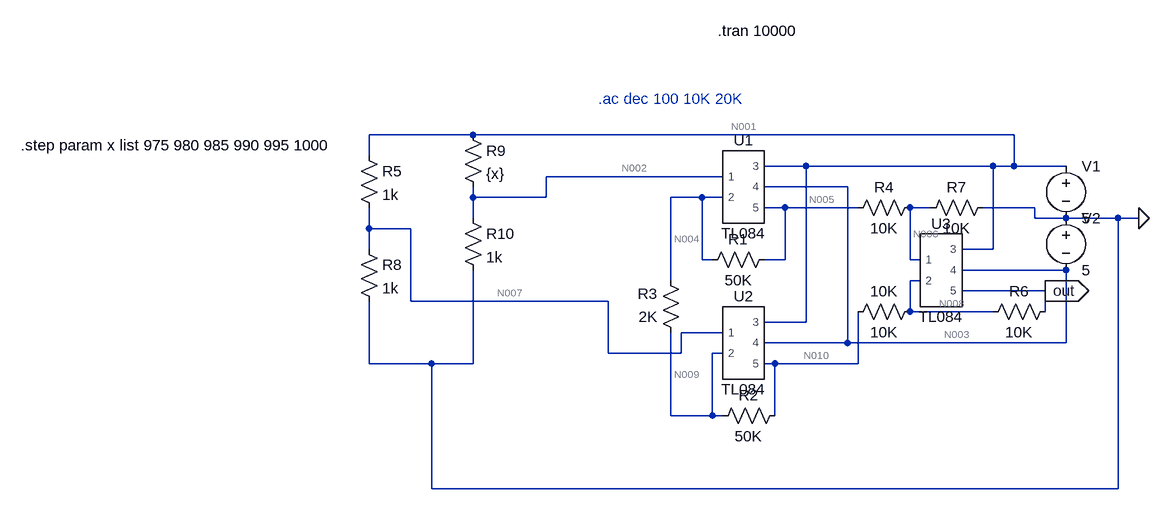
[diagram p0: schematic Draft4.asc]
Draft4.asc, the LTspice schematic file:
Version 4
SHEET 1 880 680
WIRE -400 -48 -560 -48
WIRE 432 -48 -400 -48
WIRE -560 -16 -560 -48
WIRE 112 0 48 0
WIRE 400 0 112 0
WIRE 432 0 432 -48
WIRE 432 0 400 0
WIRE 512 0 432 0
WIRE -16 16 -288 16
WIRE 176 32 48 32
WIRE -400 48 -400 32
WIRE -288 48 -288 16
WIRE -288 48 -400 48
WIRE -48 48 -96 48
WIRE -16 48 -48 48
WIRE 80 64 48 64
WIRE 192 64 80 64
WIRE 304 64 272 64
WIRE 464 64 384 64
WIRE -400 80 -400 48
WIRE 464 80 464 64
WIRE 512 80 464 80
WIRE 592 80 512 80
WIRE 624 80 592 80
WIRE -560 96 -560 64
WIRE -496 96 -560 96
WIRE -560 128 -560 96
WIRE 400 128 400 0
WIRE 400 128 352 128
WIRE -48 144 -48 48
WIRE -32 144 -48 144
WIRE 80 144 80 64
WIRE 80 144 48 144
WIRE 272 144 272 64
WIRE 288 144 272 144
WIRE 512 160 352 160
WIRE -96 176 -96 48
WIRE 288 176 272 176
WIRE 480 192 352 192
WIRE -496 208 -496 96
WIRE -192 208 -496 208
WIRE 272 224 272 176
WIRE 400 224 272 224
WIRE 480 224 480 192
WIRE 112 240 112 0
WIRE 112 240 48 240
WIRE -16 256 -80 256
WIRE 176 272 176 32
WIRE 176 272 48 272
WIRE 512 272 512 160
WIRE 512 272 176 272
WIRE -192 288 -192 208
WIRE -80 288 -80 256
WIRE -80 288 -192 288
WIRE -16 288 -32 288
WIRE -560 304 -560 208
WIRE -464 304 -560 304
WIRE -400 304 -400 160
WIRE -400 304 -464 304
WIRE 64 304 48 304
WIRE 192 304 192 224
WIRE 192 304 64 304
WIRE -96 384 -96 256
WIRE -32 384 -32 288
WIRE -32 384 -96 384
WIRE -16 384 -32 384
WIRE 64 384 64 304
WIRE -464 496 -464 304
WIRE 592 496 592 80
WIRE 592 496 -464 496
FLAG 624 80 0
FLAG 480 192 out
IOPIN 480 192 Out
SYMBOL TL084 16 32 R0
SYMATTR InstName U1
SYMBOL TL084 16 272 R0
SYMATTR InstName U2
SYMBOL TL084 320 160 R0
SYMATTR InstName U3
SYMBOL voltage 512 -16 R0
WINDOW 123 0 0 Left 0
WINDOW 39 0 0 Left 0
SYMATTR InstName V1
SYMATTR Value 5
SYMBOL voltage 512 64 R0
WINDOW 123 0 0 Left 0
WINDOW 39 0 0 Left 0
SYMATTR InstName V2
SYMATTR Value 5
SYMBOL res 64 128 R90
WINDOW 0 0 56 VBottom 2
WINDOW 3 32 56 VTop 2
SYMATTR InstName R1
SYMATTR Value 50K
SYMBOL res 80 368 R90
WINDOW 0 0 56 VBottom 2
WINDOW 3 32 56 VTop 2
SYMATTR InstName R2
SYMATTR Value 50K
SYMBOL res -80 272 R180
WINDOW 0 36 76 Left 2
WINDOW 3 36 40 Left 2
SYMATTR InstName R3
SYMATTR Value 2K
SYMBOL res 176 80 R270
WINDOW 0 32 56 VTop 2
WINDOW 3 0 56 VBottom 2
SYMATTR InstName R4
SYMATTR Value 10K
SYMBOL res 176 240 R270
WINDOW 0 32 56 VTop 2
WINDOW 3 0 56 VBottom 2
SYMATTR InstName 10K
SYMATTR Value 10K
SYMBOL res 384 240 R270
WINDOW 0 32 56 VTop 2
WINDOW 3 0 56 VBottom 2
SYMATTR InstName R6
SYMATTR Value 10K
SYMBOL res 288 80 R270
WINDOW 0 32 56 VTop 2
WINDOW 3 0 56 VBottom 2
SYMATTR InstName R7
SYMATTR Value 10K
SYMBOL res -576 -32 R0
SYMATTR InstName R5
SYMATTR Value 1k
SYMBOL res -576 112 R0
SYMATTR InstName R8
SYMATTR Value 1k
SYMBOL res -416 -64 R0
SYMATTR InstName R9
SYMATTR Value {x}
SYMBOL res -416 64 R0
SYMATTR InstName R10
SYMATTR Value 1k
TEXT -24 -208 Left 2 !.tran 10000
TEXT -208 -104 Left 2 ;.ac dec 100 10K 20K
TEXT -1096 -32 Left 2 !.step param x list 975 980 985 990 995 1000

The netlist it stands for:
* Draft4.asc
XU1 N002 N004 N001 N003 N005 TL084  ; pins 1 2 3 4 5
XU2 N007 N009 N001 N003 N010 TL084  ; pins 1 2 3 4 5
XU3 N006 N008 N001 N003 out TL084  ; pins 1 2 3 4 5
V1 N001 0 5
V2 0 N003 5
R1 N005 N004 50K
R2 N010 N009 50K
R3 N009 N004 2K
R4 N005 N006 10K
R§10K N010 N008 10K
R6 N008 out 10K
R7 N006 0 10K
R5 N001 N007 1k
R8 N007 0 1k
R9 N001 N002 {x}
R10 N002 0 1k
.tran 10000
* .ac dec 100 10K 20K
.step param x list 975 980 985 990 995 1000
.lib C:\Users\Aristotle\Documents\LTspice\TL084.301
.backanno
.end

* Results of the author's LTspice run, read from the files saved beside the schematic
* Operating Point (first step), zero values left out:
*   x = 975 
*   V(n005) = 3.303 V
*   V(n003) = -5 V
*   V(n001) = 5 V
*   V(n004) = 2.531 V
*   V(n002) = 2.532 V
*   V(n010) = 1.728 V
*   V(n009) = 2.5 V
*   V(n007) = 2.5 V
*   V(out) = 1.576 V
*   V(n008) = 1.652 V
*   V(n006) = 1.652 V
*   I(R1) = 15.45 µA
*   I(R2) = -15.45 µA
*   I(R3) = -15.45 µA
*   I(R4) = 165.2 µA
*   I(10k) = 7.593 µA
*   I(R6) = 7.593 µA
*   I(R7) = 165.2 µA
*   I(R5) = 2.5 mA
*   I(R8) = 2.5 mA
*   I(R9) = 2.532 mA
*   I(R10) = 2.532 mA
*   I(V1) = -19.62 mA
*   I(V2) = -14.58 mA
*   Ix(u1:1) = 37.59 pA
*   Ix(u1:2) = 37.59 pA
*   Ix(u1:3) = 4.861 mA
*   Ix(u1:4) = -4.859 mA
*   Ix(u1:5) = -180.6 µA
*   Ix(u2:1) = 37.56 pA
*   Ix(u2:2) = 37.56 pA
*   Ix(u2:3) = 4.861 mA
*   Ix(u2:4) = -4.859 mA
*   Ix(u2:5) = 7.855 µA
*   Ix(u3:1) = 36.71 pA
*   Ix(u3:2) = 36.71 pA
*   Ix(u3:3) = 4.861 mA
*   Ix(u3:4) = -4.86 mA
*   Ix(u3:5) = 7.593 µA
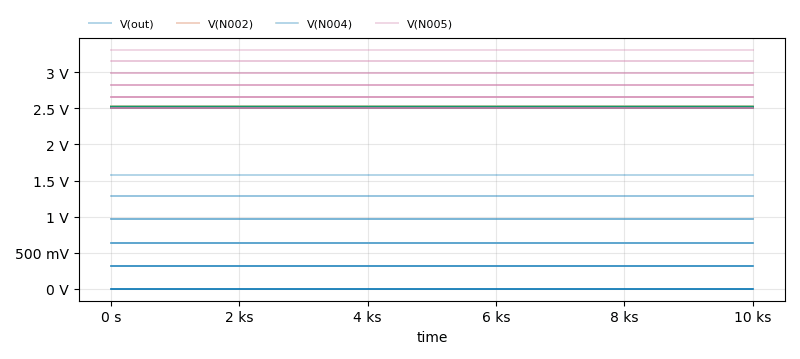
[diagram p1: Transient Analysis of Draft4.asc, plotted from the saved traces]
* Transient Analysis, 6 runs:
*   V(out) [x=975]: min 1.576 V, max 1.576 V, average 1.576 V, rms 1.576 V, last 1.576 V
*   V(out) [x=980]: min 1.287 V, max 1.287 V, average 1.287 V, rms 1.287 V, last 1.287 V
*   V(out) [x=985]: min 963.2 mV, max 963.2 mV, average 963.2 mV, rms 963.2 mV, last 963.2 mV
*   V(out) [x=990]: min 640.5 mV, max 640.5 mV, average 640.5 mV, rms 640.5 mV, last 640.5 mV
*   V(out) [x=995]: min 319.4 mV, max 319.4 mV, average 319.4 mV, rms 319.4 mV, last 319.4 mV
*   V(out) [x=1000]: min -46.58 µV, max -46.55 µV, average -46.58 µV, rms 46.58 µV, last -46.58 µV
*   V(N002) [x=975]: min 2.532 V, max 2.532 V, average 2.532 V, rms 2.532 V, last 2.532 V
*   V(N002) [x=980]: min 2.525 V, max 2.525 V, average 2.525 V, rms 2.525 V, last 2.525 V
*   V(N002) [x=985]: min 2.519 V, max 2.519 V, average 2.519 V, rms 2.519 V, last 2.519 V
*   V(N002) [x=990]: min 2.513 V, max 2.513 V, average 2.513 V, rms 2.513 V, last 2.513 V
*   V(N002) [x=995]: min 2.506 V, max 2.506 V, average 2.506 V, rms 2.506 V, last 2.506 V
*   V(N002) [x=1000]: min 2.5 V, max 2.5 V, average 2.5 V, rms 2.5 V, last 2.5 V
*   V(N004) [x=975]: min 2.531 V, max 2.531 V, average 2.531 V, rms 2.531 V, last 2.531 V
*   V(N004) [x=980]: min 2.525 V, max 2.525 V, average 2.525 V, rms 2.525 V, last 2.525 V
*   V(N004) [x=985]: min 2.519 V, max 2.519 V, average 2.519 V, rms 2.519 V, last 2.519 V
*   V(N004) [x=990]: min 2.512 V, max 2.512 V, average 2.512 V, rms 2.512 V, last 2.512 V
*   V(N004) [x=995]: min 2.506 V, max 2.506 V, average 2.506 V, rms 2.506 V, last 2.506 V
*   V(N004) [x=1000]: min 2.5 V, max 2.5 V, average 2.5 V, rms 2.5 V, last 2.5 V
*   V(N005) [x=975]: min 3.303 V, max 3.303 V, average 3.303 V, rms 3.303 V, last 3.303 V
*   V(N005) [x=980]: min 3.156 V, max 3.156 V, average 3.156 V, rms 3.156 V, last 3.156 V
*   V(N005) [x=985]: min 2.991 V, max 2.991 V, average 2.991 V, rms 2.991 V, last 2.991 V
*   V(N005) [x=990]: min 2.826 V, max 2.826 V, average 2.826 V, rms 2.826 V, last 2.826 V
*   V(N005) [x=995]: min 2.663 V, max 2.663 V, average 2.663 V, rms 2.663 V, last 2.663 V
*   V(N005) [x=1000]: min 2.5 V, max 2.5 V, average 2.5 V, rms 2.5 V, last 2.5 V